# EasyEDA schematic LcsNodes-Smart-Turnout-Socket-B.00.01.json
TITLE: Sheet_1; REV: 1.0; Date: 2026-01-16; Sheet: 1/1; Drawn By: helmut-f; Company: Your Company
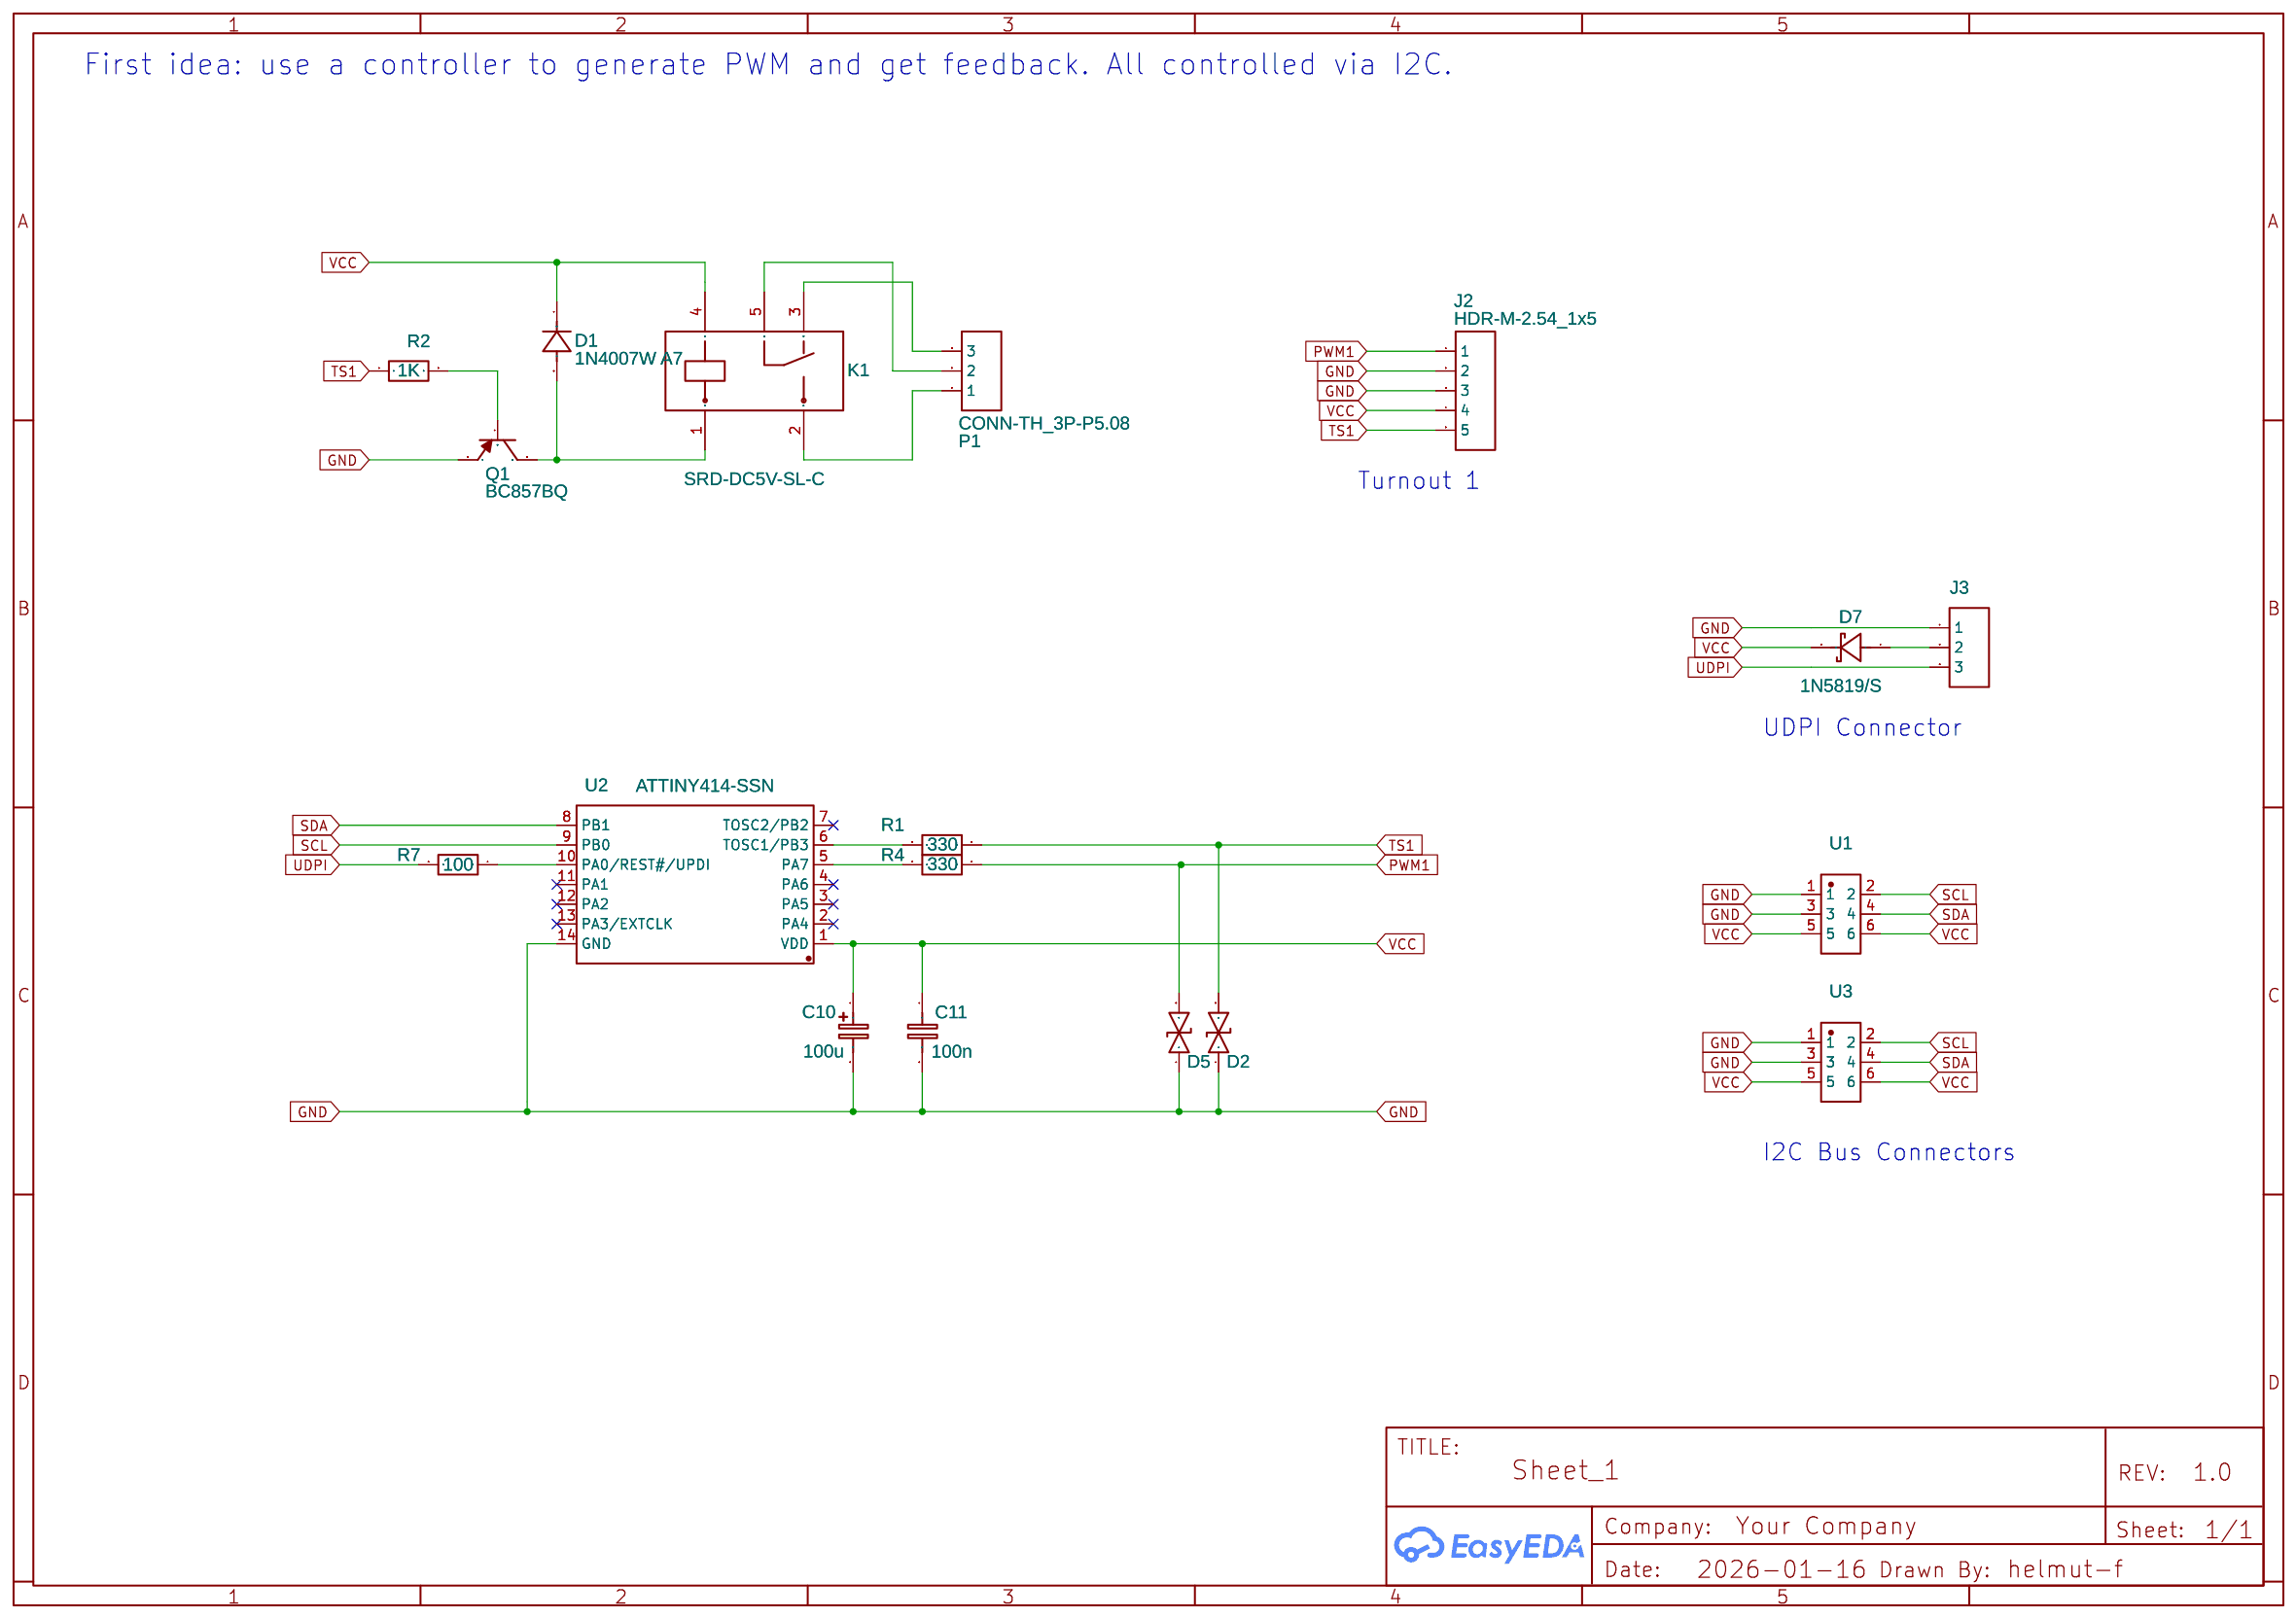
[diagram p0: schematic sheet]

## Parts
C10  100u  [CAP-SMD_BD6.3-L6.6-W6.6-LS7.6-FD]
C11  100n  [C1206]
D1  1N4007W A7  [SOD-123_L2.8-W1.8-LS3.7-RD-3]
D2  P4SMAJ5.0CA_R1_00001  [SMA_L4.4-W2.6-LS5.0-BI]
D5  P4SMAJ5.0CA_R1_00001  [SMA_L4.4-W2.6-LS5.0-BI]
D7  1N5819/S  [SMA_L4.3-W2.6-LS5.2-R-RD]
J2  HDR-M-2.54_1x5  [HDR-M-2.54_1X5]
J3  HDR-M-2.54_1x3  [HDR-M-2.54_1X3]
K1  SRD-DC5V-SL-C  [RELAY-TH_SRD-DCXXV-SL-C]
P1  CONN-TH_3P-P5.08  [CONN-TH_3P-P5.08]
Q1  BC857BQ  [SOT-23-3_L2.9-W1.6-P1.90-LS2.8-BR]
R1  330  [R1206]
R2  1K  [R1206]
R4  330  [R1206]
R7  100  [R1206]
U1  RJ12MINIRJ45_6P6C  [RJ12-TH_RJ12MINIRJ45_6P6C]
U2  ATTINY414-SSN  [SOIC-14_L8.7-W3.9-P1.27-LS6.0-BL]
U3  RJ12MINIRJ45_6P6C  [RJ12-TH_RJ12MINIRJ45_6P6C]

## Library data of the parts
C10 = CE_TH_D4.0×F1.5_EU: Contributor: LCEDA_Lib
C11 = C_0603_EU: Contributor: LCEDA_Lib; Package Display: No
D1 = 1N4007W A7: Supplier: LCSC; Supplier Part: C2857183; Manufacturer: JSMSEMI(杰盛微); JLCPCB Part Class: Extended Part; Contributor: lcsc
D2 D5 = P4SMAJ5.0CA_R1_00001: Contributor: LCSC; Supplier: LCSC; Supplier Part: C313145; Manufacturer: PANJIT(强茂); JLCPCB Part Class: Extended Part
D7 = 1N5819/S: Supplier: LCSC; Supplier Part: C9900003833; JLCPCB Part Class: Extended Part; Contributor: LCSC
J2 = HDR-M-2.54_1x5: Supplier Part: C358687; Supplier: LCSC; Contributor: LCEDA_Lib
J3 = HDR-M-2.54_1x3: Supplier Part: C180248; Supplier: LCSC; Contributor: LCEDA_Lib
K1 = SRD-DC5V-SL-C: Contributor: LCSC; Supplier: LCSC; Supplier Part: C688865; Manufacturer: null; JLCPCB Part Class: Extended Part
P1 = CONN-TH_3P-P5.08: Supplier: LCSC; Contributor: LCEDA_Lib
Q1 = BC857BQ: Contributor: LCSC; Supplier: LCSC; Supplier Part: C2927852; Manufacturer: YANGJIE(扬杰); JLCPCB Part Class: Extended Part
R1 R2 R4 R7 = R_0805_EU: Contributor: LCEDA_Lib
U1 U3 = RJ12MINIRJ45_6P6C: Supplier: LCSC; Supplier Part: C9900103926; Manufacturer: null; Contributor: lcsc; JLCPCB Part Class: Extended Part
U2 = ATTINY414-SSN: Contributor: LCSC; Supplier: LCSC; Supplier Part: C1338968; Manufacturer: MICROCHIP(美国微芯)

## Nets
GND: C10.2 C11.2 D2.1 D5.1 J2.2 J2.3 J3.1 Q1.2(E) U1.1 U1.3 U2.14(GND) U3.1 U3.3
VCC: C10.1 C11.1 D1.1(C) D7.2(K) J2.4 K1.4 U1.5 U1.6 U2.1(VDD) U3.5 U3.6
PWM1: D5.2 J2.1 R4.1
SCL: U1.2 U2.9(PB0) U3.2
SDA: U1.4 U2.8(PB1) U3.4
TS1: D2.2 J2.5 R1.1 R2.1
UDPI: J3.3 R7.2
Net-(D1-2): D1.2(A) K1.1 Q1.3(C)
Net-(D7-1): D7.1(A) J3.2
Net-(K1-2): K1.2 P1.1
Net-(K1-3): K1.3 P1.3
Net-(K1-5): K1.5 P1.2
Net-(Q1-1): Q1.1(B) R2.2
Net-(R1-2): R1.2 U2.6(TOSC1/PB3)
Net-(R4-2): R4.2 U2.5(PA7)
Net-(R7-1): R7.1 U2.10(PA0/REST#/UPDI)

Not connected (* = marked no-connect by the designer): U2 2(PA4)* 3(PA5)* 4(PA6)* 7(TOSC2/PB2)* 11(PA1)* 12(PA2)* 13(PA3/EXTCLK)*

## Notes on the sheet
- First idea: use a controller to generate PWM and get feedback. All controlled via I2C.
- Turnout 1
- UDPI Connector
- I2C Bus Connectors
